# EAGLE design tc4_shieldproto (EAGLE 5.10)
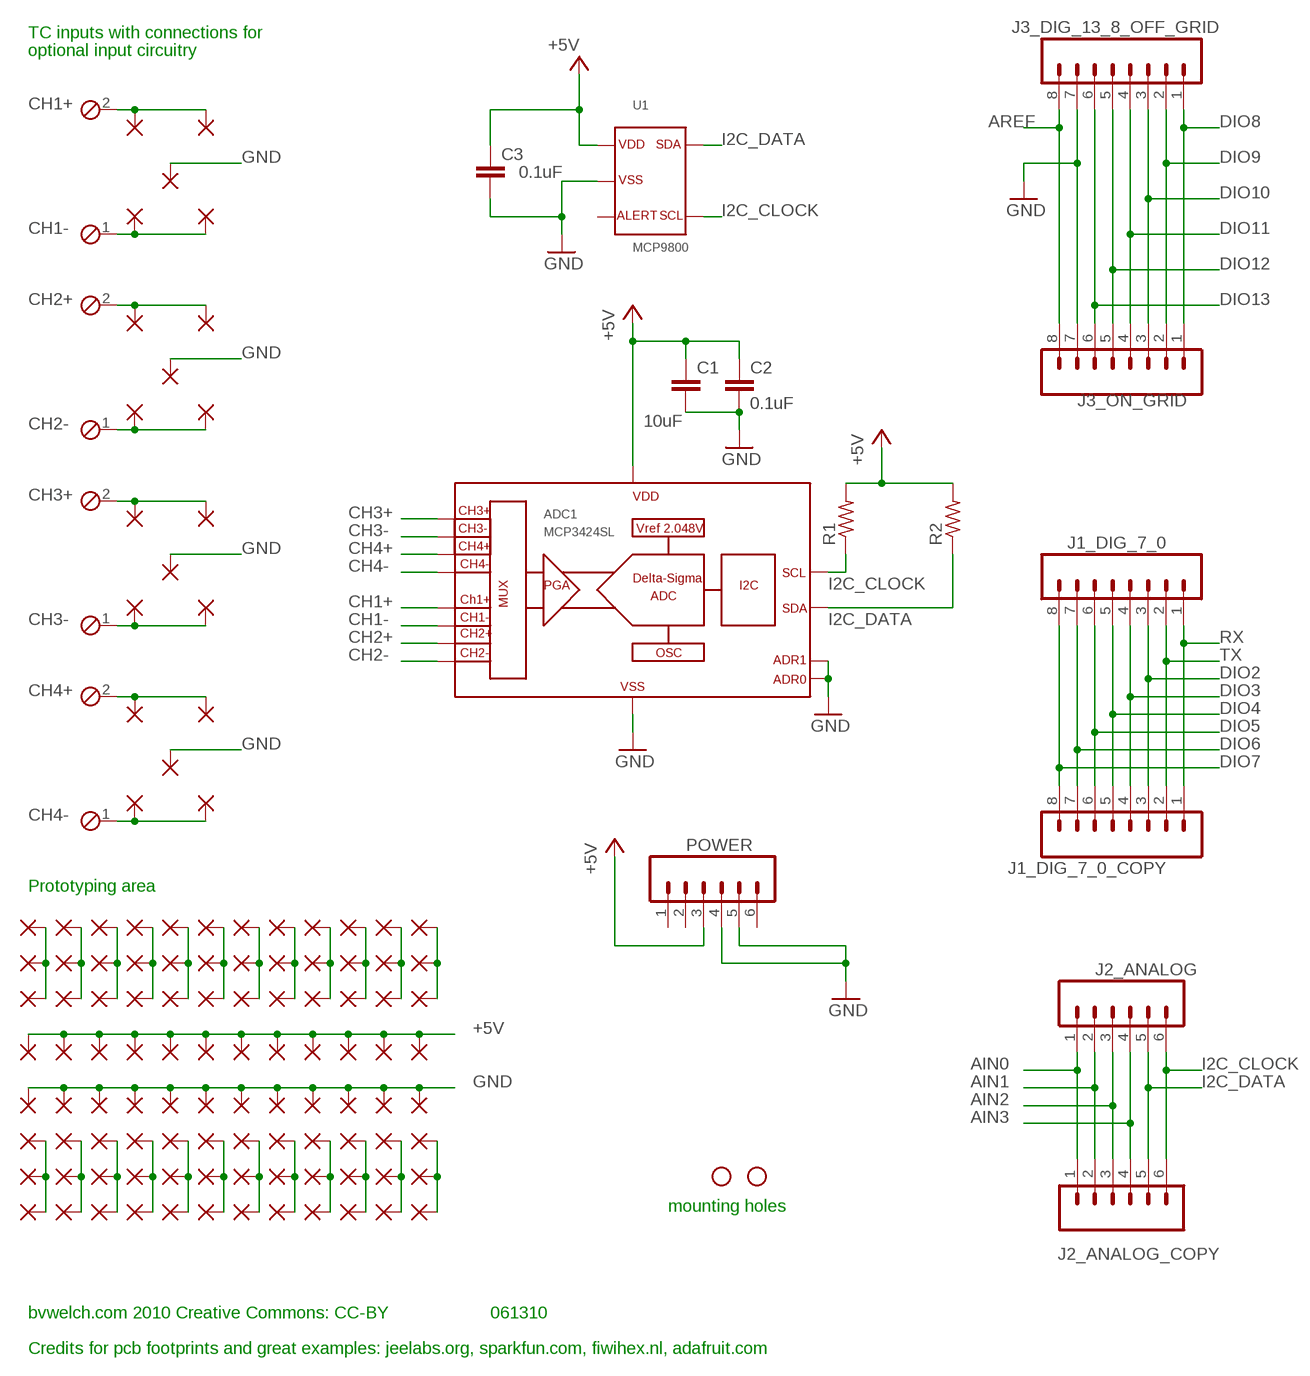
[diagram p0: schematic, sheet 1]

## Parts
ADC1  MCP3424SL  [SO14]
C1  10uF  C-EUC1206  [C1206]
C2  0.1uF  C-EUC1206  [C1206]
C3  0.1uF  C-EUC1206  [C1206]
J1_DIG_7_0  M08  [1X08]
J1_DIG_7_0_COPY  M08  [1X08]
J2_ANALOG  M06SIP  [1X06]
J2_ANALOG_COPY  M06SIP  [1X06]
J3_DIG_13_8_OFF_GRID  M08  [1X08]
J3_ON_GRID  M08  [1X08]
JP1  STAND-OFF  [STAND-OFF]
JP2  STAND-OFF  [STAND-OFF]
PAD1  1,6/0,8  [1,6/0,8]
PAD2  WIREPAD1,6/0,8  [1,6/0,8]
PAD3  1,6/0,8  [1,6/0,8]
PAD4  WIREPAD1,6/0,8  [1,6/0,8]
PAD5  WIREPAD1,6/0,8  [1,6/0,8]
PAD6  1,6/0,8  [1,6/0,8]
PAD7  1,6/0,8  [1,6/0,8]
PAD8  WIREPAD1,6/0,8  [1,6/0,8]
PAD9  1,6/0,8  [1,6/0,8]
PAD10  1,6/0,8  [1,6/0,8]
PAD11  WIREPAD1,6/0,8  [1,6/0,8]
PAD12  1,6/0,8  [1,6/0,8]
PAD13  WIREPAD1,6/0,8  [1,6/0,8]
PAD14  WIREPAD1,6/0,8  [1,6/0,8]
PAD15  1,6/0,8  [1,6/0,8]
PAD16  1,6/0,8  [1,6/0,8]
PAD17  WIREPAD1,6/0,8  [1,6/0,8]
PAD18  1,6/0,8  [1,6/0,8]
PAD19  1,6/0,8  [1,6/0,8]
PAD20  WIREPAD1,6/0,8  [1,6/0,8]
PAD21  1,6/0,8  [1,6/0,8]
PAD22  WIREPAD1,6/0,8  [1,6/0,8]
PAD23  WIREPAD1,6/0,8  [1,6/0,8]
PAD24  1,6/0,8  [1,6/0,8]
PAD25  1,6/0,8  [1,6/0,8]
PAD26  WIREPAD1,6/0,8  [1,6/0,8]
PAD27  1,6/0,8  [1,6/0,8]
PAD28  1,6/0,8  [1,6/0,8]
PAD29  WIREPAD1,6/0,8  [1,6/0,8]
PAD30  1,6/0,8  [1,6/0,8]
PAD31  WIREPAD1,6/0,8  [1,6/0,8]
PAD32  WIREPAD1,6/0,8  [1,6/0,8]
PAD33  1,6/0,8  [1,6/0,8]
PAD34  1,6/0,8  [1,6/0,8]
PAD35  WIREPAD1,6/0,8  [1,6/0,8]
PAD36  1,6/0,8  [1,6/0,8]
PAD37  WIREPAD1,6/0,8  [1,6/0,8]
PAD38  WIREPAD1,6/0,8  [1,6/0,8]
PAD39  WIREPAD1,6/0,8  [1,6/0,8]
PAD40  WIREPAD1,6/0,8  [1,6/0,8]
PAD41  WIREPAD1,6/0,8  [1,6/0,8]
PAD42  WIREPAD1,6/0,8  [1,6/0,8]
PAD43  WIREPAD1,6/0,8  [1,6/0,8]
PAD44  WIREPAD1,6/0,8  [1,6/0,8]
PAD45  WIREPAD1,6/0,8  [1,6/0,8]
PAD46  WIREPAD1,6/0,8  [1,6/0,8]
PAD47  WIREPAD1,6/0,8  [1,6/0,8]
PAD48  WIREPAD1,6/0,8  [1,6/0,8]
PAD49  WIREPAD1,6/0,8  [1,6/0,8]
PAD50  WIREPAD1,6/0,8  [1,6/0,8]
PAD51  WIREPAD1,6/0,8  [1,6/0,8]
PAD52  WIREPAD1,6/0,8  [1,6/0,8]
PAD53  WIREPAD1,6/0,8  [1,6/0,8]
PAD54  WIREPAD1,6/0,8  [1,6/0,8]
PAD55  WIREPAD1,6/0,8  [1,6/0,8]
PAD56  WIREPAD1,6/0,8  [1,6/0,8]
PAD57  WIREPAD1,6/0,8  [1,6/0,8]
PAD58  WIREPAD1,6/0,8  [1,6/0,8]
PAD59  WIREPAD1,6/0,8  [1,6/0,8]
PAD60  WIREPAD1,6/0,8  [1,6/0,8]
PAD61  WIREPAD1,6/0,8  [1,6/0,8]
PAD62  WIREPAD1,6/0,8  [1,6/0,8]
PAD63  WIREPAD1,6/0,8  [1,6/0,8]
PAD64  WIREPAD1,6/0,8  [1,6/0,8]
PAD65  WIREPAD1,6/0,8  [1,6/0,8]
PAD66  WIREPAD1,6/0,8  [1,6/0,8]
PAD67  WIREPAD1,6/0,8  [1,6/0,8]
PAD68  WIREPAD1,6/0,8  [1,6/0,8]
PAD69  WIREPAD1,6/0,8  [1,6/0,8]
PAD70  WIREPAD1,6/0,8  [1,6/0,8]
PAD71  WIREPAD1,6/0,8  [1,6/0,8]
PAD72  WIREPAD1,6/0,8  [1,6/0,8]
PAD73  WIREPAD1,6/0,8  [1,6/0,8]
PAD74  WIREPAD1,6/0,8  [1,6/0,8]
PAD75  WIREPAD1,6/0,8  [1,6/0,8]
PAD76  WIREPAD1,6/0,8  [1,6/0,8]
PAD77  WIREPAD1,6/0,8  [1,6/0,8]
PAD78  WIREPAD1,6/0,8  [1,6/0,8]
PAD79  WIREPAD1,6/0,8  [1,6/0,8]
PAD80  WIREPAD1,6/0,8  [1,6/0,8]
PAD81  WIREPAD1,6/0,8  [1,6/0,8]
PAD82  WIREPAD1,6/0,8  [1,6/0,8]
PAD83  WIREPAD1,6/0,8  [1,6/0,8]
PAD84  WIREPAD1,6/0,8  [1,6/0,8]
PAD85  WIREPAD1,6/0,8  [1,6/0,8]
PAD86  WIREPAD1,6/0,8  [1,6/0,8]
PAD87  WIREPAD1,6/0,8  [1,6/0,8]
PAD88  WIREPAD1,6/0,8  [1,6/0,8]
PAD89  WIREPAD1,6/0,8  [1,6/0,8]
PAD90  WIREPAD1,6/0,8  [1,6/0,8]
PAD91  WIREPAD1,6/0,8  [1,6/0,8]
PAD92  WIREPAD1,6/0,8  [1,6/0,8]
PAD93  WIREPAD1,6/0,8  [1,6/0,8]
PAD94  WIREPAD1,6/0,8  [1,6/0,8]
PAD95  WIREPAD1,6/0,8  [1,6/0,8]
PAD96  WIREPAD1,6/0,8  [1,6/0,8]
PAD97  WIREPAD1,6/0,8  [1,6/0,8]
PAD98  WIREPAD1,6/0,8  [1,6/0,8]
PAD99  WIREPAD1,6/0,8  [1,6/0,8]
PAD100  WIREPAD1,6/0,8  [1,6/0,8]
PAD101  WIREPAD1,6/0,8  [1,6/0,8]
PAD102  WIREPAD1,6/0,8  [1,6/0,8]
PAD103  WIREPAD1,6/0,8  [1,6/0,8]
PAD104  WIREPAD1,6/0,8  [1,6/0,8]
PAD105  WIREPAD1,6/0,8  [1,6/0,8]
PAD106  WIREPAD1,6/0,8  [1,6/0,8]
PAD107  WIREPAD1,6/0,8  [1,6/0,8]
PAD108  WIREPAD1,6/0,8  [1,6/0,8]
PAD109  WIREPAD1,6/0,8  [1,6/0,8]
PAD110  WIREPAD1,6/0,8  [1,6/0,8]
PAD111  WIREPAD1,6/0,8  [1,6/0,8]
PAD112  WIREPAD1,6/0,8  [1,6/0,8]
PAD113  WIREPAD1,6/0,8  [1,6/0,8]
PAD114  WIREPAD1,6/0,8  [1,6/0,8]
PAD115  WIREPAD1,6/0,8  [1,6/0,8]
PAD116  WIREPAD1,6/0,8  [1,6/0,8]
POWER  M06SIP  [1X06]
R1  R-US_R1206  [R1206]
R2  R-US_R1206  [R1206]
TC1  MPT2  [2POL254]
TC2  MPT2  [2POL254]
TC3  MPT2  [2POL254]
TC4  MPT2  [2POL254]
U1  MCP9800  [SOT23-5L]

## Nets
+5V: ADC1.6 C1.1 C2.1 C3.1 PAD2.1(P) PAD4.1(P) PAD5.1(P) PAD8.1(P) PAD13.1(P) PAD17.1(P) PAD20.1(P) PAD23.1(P) PAD26.1(P) PAD29.1(P) PAD32.1(P) PAD35.1(P) POWER.3 R1.2 R2.2 U1.1
AIN0: J2_ANALOG.1 J2_ANALOG_COPY.1
AIN1: J2_ANALOG.2 J2_ANALOG_COPY.2
AIN2: J2_ANALOG.3 J2_ANALOG_COPY.3
AIN3: J2_ANALOG.4 J2_ANALOG_COPY.4
AREF: J3_DIG_13_8_OFF_GRID.8 J3_ON_GRID.8
CH1+: ADC1.1 PAD19.1(P) PAD21.1(P) TC1.2
CH1-: ADC1.2 PAD25.1(P) PAD27.1(P) TC1.1
CH2+: ADC1.3 PAD28.1(P) PAD30.1(P) TC2.2
CH2-: ADC1.4 PAD34.1(P) PAD36.1(P) TC2.1
CH3+: ADC1.11 PAD1.1(P) PAD3.1(P) TC3.2
CH3-: ADC1.12 PAD7.1(P) PAD9.1(P) TC3.1
CH4+: ADC1.13 PAD10.1(P) PAD12.1(P) TC4.2
CH4-: ADC1.14 PAD16.1(P) PAD18.1(P) TC4.1
DIO2: J1_DIG_7_0.3 J1_DIG_7_0_COPY.3
DIO3: J1_DIG_7_0.4 J1_DIG_7_0_COPY.4
DIO4: J1_DIG_7_0.5 J1_DIG_7_0_COPY.5
DIO5: J1_DIG_7_0.6 J1_DIG_7_0_COPY.6
DIO6: J1_DIG_7_0.7 J1_DIG_7_0_COPY.7
DIO7: J1_DIG_7_0.8 J1_DIG_7_0_COPY.8
DIO8: J3_DIG_13_8_OFF_GRID.1 J3_ON_GRID.1
DIO9: J3_DIG_13_8_OFF_GRID.2 J3_ON_GRID.2
DIO10: J3_DIG_13_8_OFF_GRID.3 J3_ON_GRID.3
DIO11: J3_DIG_13_8_OFF_GRID.4 J3_ON_GRID.4
DIO12: J3_DIG_13_8_OFF_GRID.5 J3_ON_GRID.5
DIO13: J3_DIG_13_8_OFF_GRID.6 J3_ON_GRID.6
GND: ADC1.5 ADC1.9 ADC1.10 C1.2 C2.2 C3.2 J3_DIG_13_8_OFF_GRID.7 J3_ON_GRID.7 PAD6.1(P) PAD11.1(P) PAD14.1(P) PAD15.1(P) PAD22.1(P) PAD24.1(P) PAD31.1(P) PAD33.1(P) PAD37.1(P) PAD42.1(P) PAD43.1(P) PAD44.1(P) PAD45.1(P) PAD46.1(P) PAD47.1(P) PAD48.1(P) POWER.4 POWER.5 U1.2
I2C_CLOCK: ADC1.8 J2_ANALOG.6 J2_ANALOG_COPY.6 R1.1 U1.4
I2C_DATA: ADC1.7 J2_ANALOG.5 J2_ANALOG_COPY.5 R2.1 U1.5
N$1: PAD49.1(P) PAD61.1(P) PAD73.1(P)
N$2: PAD50.1(P) PAD62.1(P) PAD74.1(P)
N$3: PAD51.1(P) PAD63.1(P) PAD75.1(P)
N$4: PAD52.1(P) PAD64.1(P) PAD76.1(P)
N$5: PAD53.1(P) PAD65.1(P) PAD77.1(P)
N$6: PAD54.1(P) PAD66.1(P) PAD78.1(P)
N$7: PAD55.1(P) PAD67.1(P) PAD79.1(P)
N$10: PAD38.1(P) PAD57.1(P) PAD69.1(P)
N$11: PAD39.1(P) PAD58.1(P) PAD70.1(P)
N$12: PAD40.1(P) PAD59.1(P) PAD71.1(P)
N$13: PAD85.1(P) PAD97.1(P) PAD109.1(P)
N$14: PAD86.1(P) PAD98.1(P) PAD110.1(P)
N$15: PAD87.1(P) PAD99.1(P) PAD111.1(P)
N$16: PAD88.1(P) PAD100.1(P) PAD112.1(P)
N$17: PAD89.1(P) PAD101.1(P) PAD113.1(P)
N$18: PAD90.1(P) PAD102.1(P) PAD114.1(P)
N$19: PAD91.1(P) PAD103.1(P) PAD115.1(P)
N$20: PAD41.1(P) PAD60.1(P) PAD72.1(P)
N$21: PAD56.1(P) PAD68.1(P) PAD80.1(P)
N$22: PAD81.1(P) PAD93.1(P) PAD105.1(P)
N$23: PAD82.1(P) PAD94.1(P) PAD106.1(P)
N$24: PAD83.1(P) PAD95.1(P) PAD107.1(P)
N$25: PAD84.1(P) PAD96.1(P) PAD108.1(P)
N$26: PAD92.1(P) PAD104.1(P) PAD116.1(P)
RX: J1_DIG_7_0.1 J1_DIG_7_0_COPY.1
TX: J1_DIG_7_0.2 J1_DIG_7_0_COPY.2
Unconnected: POWER.1 POWER.2 POWER.6 U1.3

## Notes on the sheet
- TC inputs with connections for
- optional input circuitry
- Prototyping area
- mounting holes
- bvwelch.com 2010 Creative Commons: CC-BY | 061310
- Credits for pcb footprints and great examples: jeelabs.org, sparkfun.com, fiwihex.nl, adafruit.com

## Library data of the parts
ADC1 = newparts_2010:MCP3424: 18-bit multi-channel delta-sigma AD converter with I2C interface. Microchip. Farnell 1630424
C1-C3 = rcl:C-EU: CAPACITOR, European symbol
J1_DIG_7_0 J1_DIG_7_0_COPY J3_DIG_13_8_OFF_GRID J3_ON_GRID = SparkFun:M08: Header 8 Standard 8-pin 0.1" header. Use with straight break away headers (SKU : PRT-00116), right angle break away headers (PRT-00553), swiss pins (PRT-00743), machine pins (PRT-00117), and female headers (PRT-00115).
J2_ANALOG J2_ANALOG_COPY POWER = SparkFun:M06: Header 6 Standard 6-pin 0.1" header. Use with straight break away headers (SKU : PRT-00116), right angle break away headers (PRT-00553), swiss pins (PRT-00743), machine pins (PRT-00117), and female headers (PRT-00115). Molex polarized connector foot print use with SKU : PRT-08094 with associated crimp pins and housings. NOTES ON THE VARIANTS LOCK and LOCK_LONGPADS... This footprint was designed to help hold the alignment of a through-hole component (i.e. 6-pin header) while soldering it into place. You may notice that each hole has been shifted either up or down by 0.005 of an inch from it's more standard position (which is a perfectly straight line). This slight alteration caused the pins (the squares in the middle) to touch the edges of the holes. Because they are alternating, it causes a "brace" to hold the component in place. 0.005 has proven to be the perfect amount of "off-center" position when using our standard breakaway headers. Although looks a little odd when you look at the bare footprint, once you have a header in there, the alteration is very hard to notice. Also, if you push a header all the way into place, it is covered up entirely on the bottom side. This idea of altering the position of holes to aid alignment will be further integrated into the Sparkfun Library for other footprints. It can help hold any component with 3 or more connection pins.
JP1 JP2 = SparkFun:STAND-OFF: Stand Off This is the mechanical footprint for a #4 phillips button head screw. Use the keepout ring to avoid running the screw head into surrounding components. SKU : PRT-00447
PAD1 PAD3 PAD6 PAD7 PAD9 PAD10 PAD12 PAD15 PAD16 PAD18 PAD19 PAD21 PAD24 PAD25 PAD27 PAD28 PAD30 PAD33 PAD34 PAD36 = wirepad:1,6/0,8: THROUGH-HOLE PAD
PAD2 PAD4 PAD5 PAD8 PAD11 PAD13 PAD14 PAD17 PAD20 PAD22 PAD23 PAD26 PAD29 PAD31 PAD32 PAD35 PAD37-PAD116 = wirepad:WIREPAD: Wire PAD connect wire on PCB
R1 R2 = rcl:R-US_: RESISTOR, American symbol
TC1-TC4 = newparts_2006:MPT2: PHOENIX CONNECTOR
U1 = newparts_2010:MCP9800: Temperature sensor I2C output, Microchip. Farnell 1439485

## Board
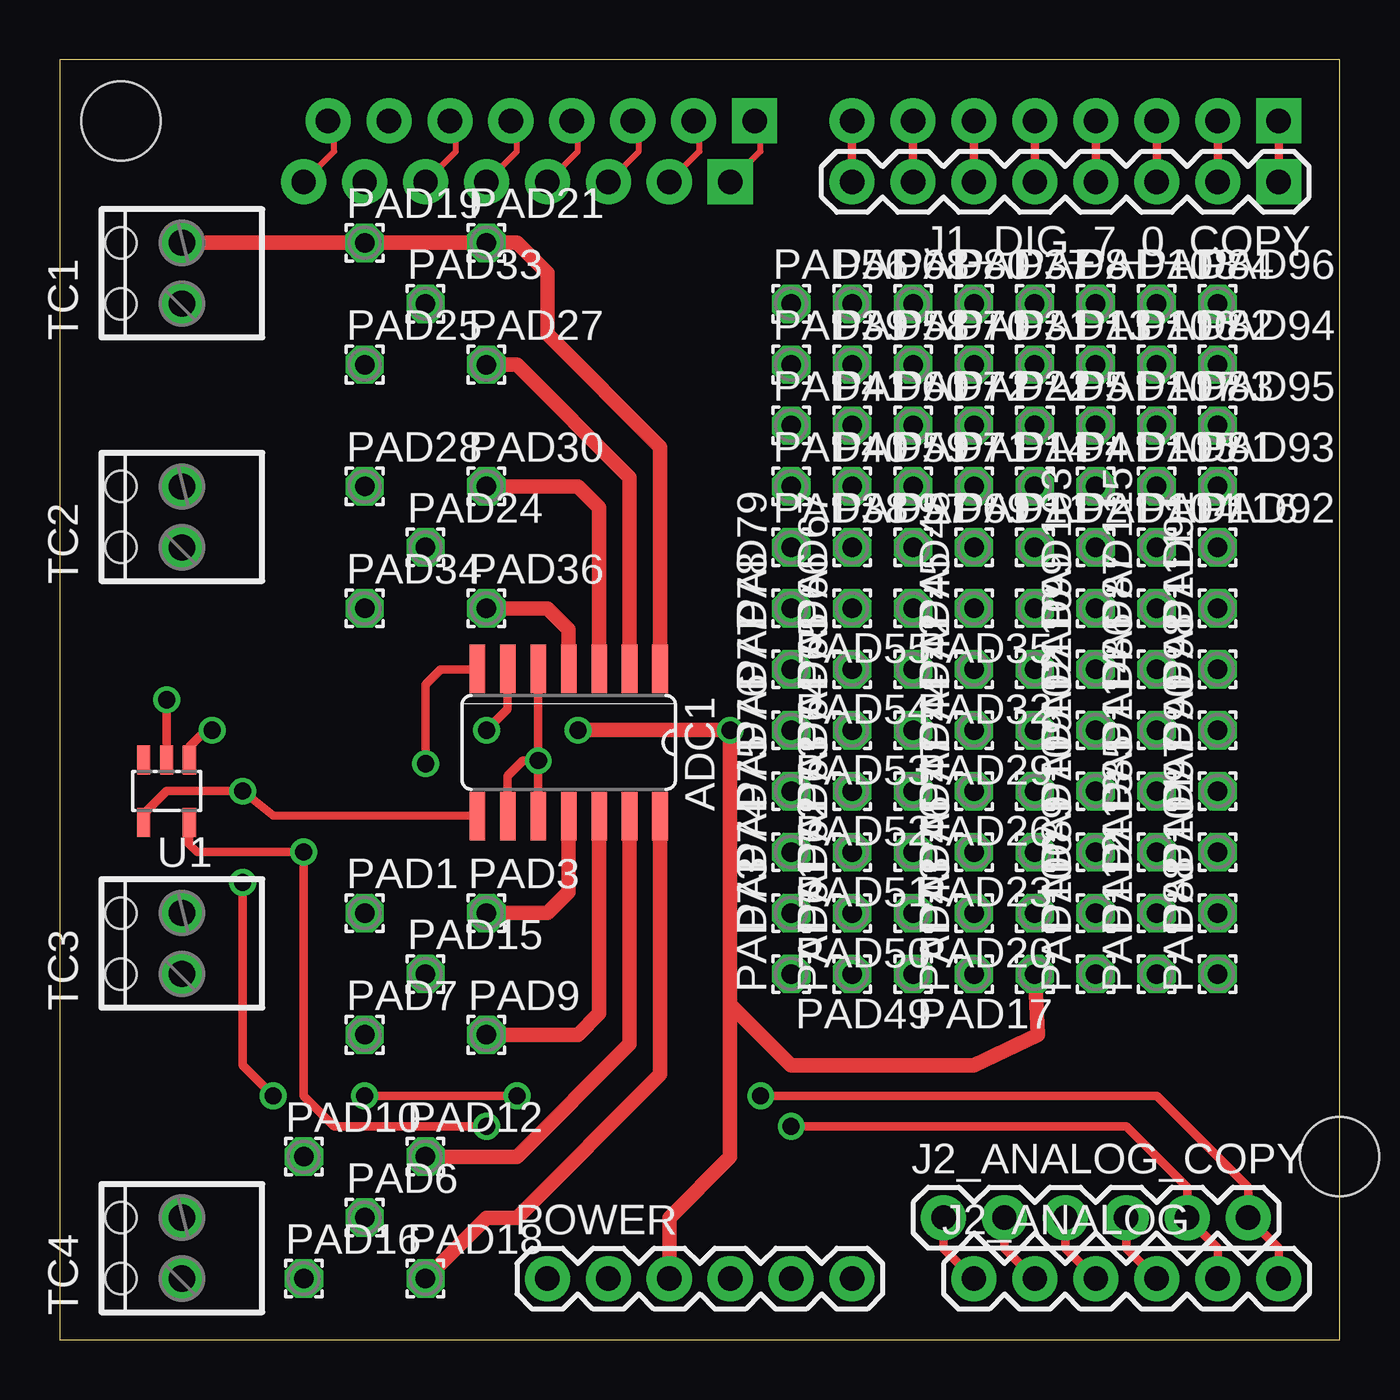
[diagram p1: board, top side]
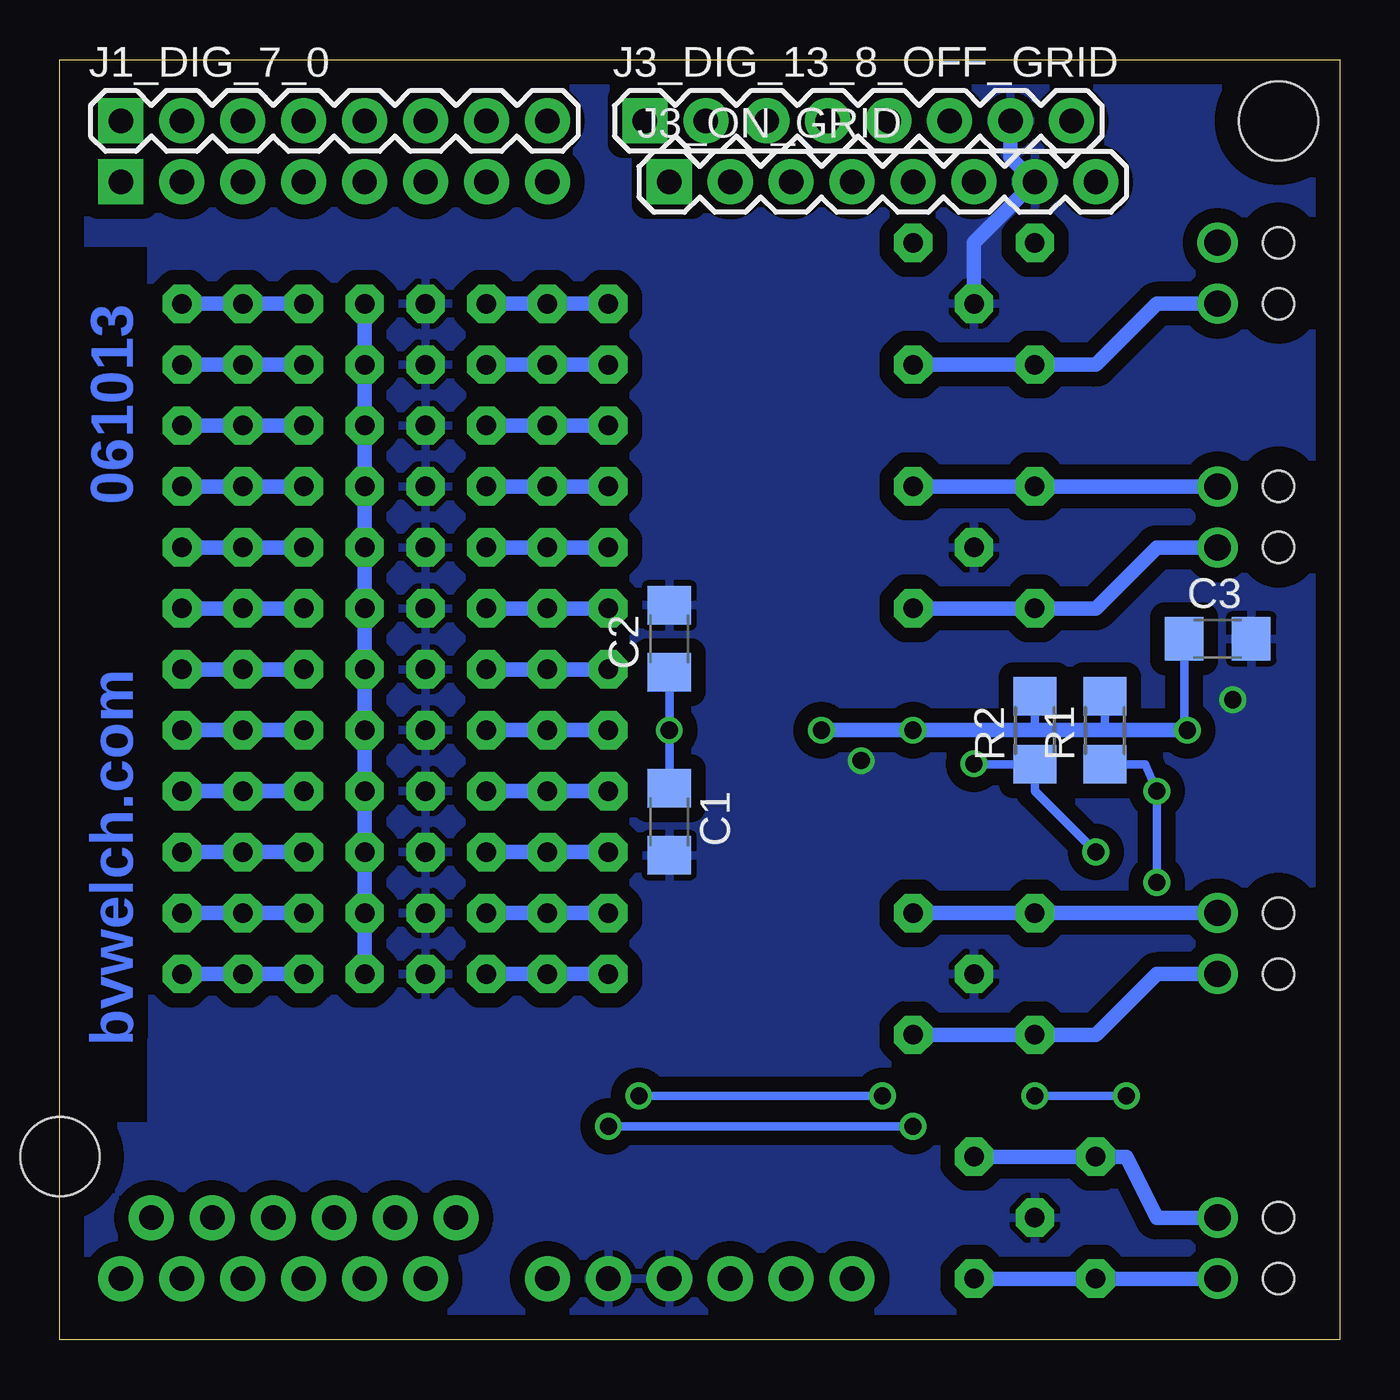
[diagram p2: board, bottom side, seen from below]

Size 53.34 x 53.34 mm. Coordinates in mm from the lower left corner, seen from the top.
Outline: 0,0 53.34,0 53.34,53.34 0,53.34 0,0
Copper layers (1*16): Top 0.035mm / dielectric 1.5mm / Bottom 0.035mm
Design rules "Olimex10mils": minimum track width 10mil, minimum drill 24mil, track to track 10mil, track to pad 10mil, pad to pad 10mil, via to via 10mil, smd to smd 10mil, copper to edge 40mil, drill to drill 10mil, minimum pad ring 10mil, minimum via ring 8mil, stop-mask expansion 0mil, vias tented up to drill 0mil, thermal gap 10mil

### Footprints (pad centres in the part's own frame; a part is rotated, then mirrored left to right if it is on the bottom)
SO14 = smd 0.66 x 2.032: 1 -3.81,-3.073; 2 -2.54,-3.073; 3 -1.27,-3.073; 4 0,-3.073; 5 1.27,-3.073; 6 2.54,-3.073; 7 3.81,-3.073; 8 3.81,3.073; 9 2.54,3.073; 10 1.27,3.073; 11 0,3.073; 12 -1.27,3.073; 13 -2.54,3.073; 14 -3.81,3.073
C1206 = smd 1.6 x 1.8: 1 -1.4,0; 2 1.4,0
1X08 = drill 1.016 pad 1.88 square: 1 0,0 | drill 1.016 pad 1.88 round: 2 2.54,0; 3 5.08,0; 4 7.62,0; 5 10.16,0; 6 12.7,0; 7 15.24,0; 8 17.78,0
1X06 = drill 1.016 pad 1.88 round: 1 0,0; 2 2.54,0; 3 5.08,0; 4 7.62,0; 5 10.16,0; 6 12.7,0
STAND-OFF = hole 3.302: 0,0
1,6/0,8 = drill 0.813 pad 1.6 octagon: 1 0,0
R1206 = smd 1.6 x 1.803: 1 -1.422,0; 2 1.422,0
2POL254 = drill 1.092 pad 1.676 round: 1 -1.27,0; 2 1.27,0 | hole 1.295: -1.27,2.54; 1.27,2.54
SOT23-5L = smd 0.55 x 1.2: 1 -0.95,-1.3; 2 0,-1.3; 3 0.95,-1.3; 4 0.95,1.3; 5 -0.95,1.3

### Placement (x,y rotation side)
ADC1  21.21,24.89 180 top
C1  27.94,21.59 270 bottom
C2  27.94,29.21 90 bottom
C3  5.08,29.21 0 bottom
J1_DIG_7_0  50.8,50.8 0 bottom
J1_DIG_7_0_COPY  50.8,48.26 180 top
J2_ANALOG  38.1,2.54 0 top
J2_ANALOG_COPY  36.83,5.08 0 top
J3_DIG_13_8_OFF_GRID  28.96,50.8 0 bottom
J3_ON_GRID  27.94,48.26 0 bottom
JP1  53.34,7.62 180 top
JP2  2.54,50.8 180 top
PAD1  12.7,17.78 0 top
PAD2  40.64,33.02 0 top
PAD3  17.78,17.78 0 top
PAD4  40.64,35.56 0 top
PAD5  40.64,38.1 0 top
PAD6  12.7,5.08 0 top
PAD7  12.7,12.7 0 top
PAD8  40.64,43.18 0 top
PAD9  17.78,12.7 0 top
PAD10  10.16,7.62 0 top
PAD11  38.1,33.02 0 top
PAD12  15.24,7.62 0 top
PAD13  40.64,40.64 0 top
PAD14  38.1,35.56 0 top
PAD15  15.24,15.24 0 top
PAD16  10.16,2.54 0 top
PAD17  40.64,15.24 180 top
PAD18  15.24,2.54 0 top
PAD19  12.7,45.72 0 top
PAD20  40.64,17.78 180 top
PAD21  17.78,45.72 0 top
PAD22  38.1,38.1 0 top
PAD23  40.64,20.32 180 top
PAD24  15.24,33.02 0 top
PAD25  12.7,40.64 0 top
PAD26  40.64,22.86 180 top
PAD27  17.78,40.64 0 top
PAD28  12.7,35.56 0 top
PAD29  40.64,25.4 180 top
PAD30  17.78,35.56 0 top
PAD31  38.1,40.64 0 top
PAD32  40.64,27.94 180 top
PAD33  15.24,43.18 0 top
PAD34  12.7,30.48 0 top
PAD35  40.64,30.48 180 top
PAD36  17.78,30.48 0 top
PAD37  38.1,43.18 0 top
PAD38  30.48,33.02 0 top
PAD39  30.48,40.64 0 top
PAD40  30.48,35.56 0 top
PAD41  30.48,38.1 0 top
PAD42  38.1,25.4 90 top
PAD43  38.1,15.24 90 top
PAD44  38.1,22.86 90 top
PAD45  38.1,27.94 90 top
PAD46  38.1,17.78 90 top
PAD47  38.1,20.32 90 top
PAD48  38.1,30.48 90 top
PAD49  35.56,15.24 180 top
PAD50  35.56,17.78 180 top
PAD51  35.56,20.32 180 top
PAD52  35.56,22.86 180 top
PAD53  35.56,25.4 180 top
PAD54  35.56,27.94 180 top
PAD55  35.56,30.48 180 top
PAD56  30.48,43.18 0 top
PAD57  33.02,33.02 0 top
PAD58  33.02,40.64 0 top
PAD59  33.02,35.56 0 top
PAD60  33.02,38.1 0 top
PAD61  33.02,15.24 90 top
PAD62  33.02,17.78 90 top
PAD63  33.02,20.32 90 top
PAD64  33.02,22.86 90 top
PAD65  33.02,25.4 90 top
PAD66  33.02,27.94 90 top
PAD67  33.02,30.48 90 top
PAD68  33.02,43.18 0 top
PAD69  35.56,33.02 0 top
PAD70  35.56,40.64 0 top
PAD71  35.56,35.56 0 top
PAD72  35.56,38.1 0 top
PAD73  30.48,15.24 90 top
PAD74  30.48,17.78 90 top
PAD75  30.48,20.32 90 top
PAD76  30.48,22.86 90 top
PAD77  30.48,25.4 90 top
PAD78  30.48,27.94 90 top
PAD79  30.48,30.48 90 top
PAD80  35.56,43.18 0 top
PAD81  45.72,35.56 0 top
PAD82  45.72,40.64 0 top
PAD83  45.72,38.1 0 top
PAD84  45.72,43.18 0 top
PAD85  45.72,20.32 90 top
PAD86  45.72,25.4 90 top
PAD87  45.72,27.94 90 top
PAD88  48.26,15.24 90 top
PAD89  43.18,17.78 90 top
PAD90  48.26,22.86 90 top
PAD91  48.26,30.48 90 top
PAD92  48.26,33.02 0 top
PAD93  48.26,35.56 0 top
PAD94  48.26,40.64 0 top
PAD95  48.26,38.1 0 top
PAD96  48.26,43.18 0 top
PAD97  48.26,20.32 90 top
PAD98  48.26,25.4 90 top
PAD99  43.18,27.94 90 top
PAD100  43.18,15.24 90 top
PAD101  48.26,17.78 90 top
PAD102  43.18,22.86 90 top
PAD103  43.18,30.48 90 top
PAD104  43.18,33.02 0 top
PAD105  43.18,35.56 0 top
PAD106  43.18,40.64 0 top
PAD107  43.18,38.1 0 top
PAD108  43.18,43.18 0 top
PAD109  43.18,20.32 90 top
PAD110  43.18,25.4 90 top
PAD111  48.26,27.94 90 top
PAD112  45.72,15.24 90 top
PAD113  45.72,17.78 90 top
PAD114  45.72,22.86 90 top
PAD115  45.72,30.48 90 top
PAD116  45.72,33.02 0 top
POWER  20.32,2.54 0 top
R1  9.78,25.4 90 bottom
R2  12.7,25.4 90 bottom
TC1  5.08,44.45 90 top
TC2  5.08,34.29 90 top
TC3  5.08,16.51 90 top
TC4  5.08,3.81 90 top
U1  4.45,22.86 180 top

### Tracks (layer width: path | path; a pad name or v marks a point on that pad's centre or on a via)
+5V  (via drill 0.71)
  Top 0.356: ADC1.6 18.67,26.29 v17.78,25.4 | U1.1 5.39,24.7 6.1,25.4 v6.35,25.4
  Top 0.61: v21.59,25.4 v27.94,25.4 27.94,13.97 | POWER.3 25.4,5.08 27.94,7.62 27.94,13.97 | PAD17.1 40.77,12.7 38.1,11.43 30.48,11.43 27.94,13.97
  Bottom 0.356: C3.1 6.48,25.53 v6.35,25.4 | R1.2 9.78,25.53 9.65,25.4 | 12.7,25.4 R2.2 | C2.1 v27.94,25.4 C1.1
  Bottom 0.61: v6.35,25.4 9.65,25.4 12.7,25.4 v17.78,25.4 v21.59,25.4 | PAD17.1 PAD20.1 PAD23.1 PAD26.1 PAD29.1 PAD32.1 PAD35.1 PAD2.1 PAD4.1 PAD5.1 PAD13.1 PAD8.1
AIN0
  Top 0.356: J2_ANALOG.1 36.83,3.81 J2_ANALOG_COPY.1
AIN1
  Top 0.356: J2_ANALOG.2 39.37,3.81 J2_ANALOG_COPY.2
AIN2
  Top 0.356: J2_ANALOG.3 41.91,3.81 J2_ANALOG_COPY.3
AIN3
  Top 0.356: J2_ANALOG.4 44.45,3.81 J2_ANALOG_COPY.4
AREF
  Top 0.254: J3_ON_GRID.8 11.43,49.53 11.43,50.8 J3_DIG_13_8_OFF_GRID.8
CH1+
  Top 0.61: TC1.2 PAD19.1 PAD21.1 19.05,45.72 20.32,44.45 20.32,41.91 25.02,37.21 ADC1.1
CH1-
  Top 0.61: ADC1.2 23.75,35.94 19.05,40.64 PAD27.1
  Bottom 0.61: TC1.1 7.62,43.18 10.16,40.64 PAD25.1 PAD27.1
CH2+
  Top 0.61: ADC1.3 22.48,34.67 21.59,35.56 PAD30.1
  Bottom 0.61: TC2.2 PAD28.1 PAD30.1
CH2-
  Top 0.61: ADC1.4 21.21,29.59 20.32,30.48 PAD36.1
  Bottom 0.61: TC2.1 7.62,33.02 10.16,30.48 PAD34.1 PAD36.1
CH3+
  Top 0.61: ADC1.11 21.21,18.67 20.32,17.78 PAD3.1
  Bottom 0.61: TC3.2 PAD1.1 PAD3.1
CH3-
  Top 0.61: ADC1.12 22.48,13.59 21.59,12.7 PAD9.1
  Bottom 0.61: TC3.1 7.62,15.24 10.16,12.7 PAD7.1 PAD9.1
CH4+
  Top 0.61: ADC1.13 23.75,12.32 19.05,7.62 PAD12.1
  Bottom 0.61: TC4.2 7.62,5.08 8.89,7.62 PAD10.1 PAD12.1
CH4-
  Top 0.61: ADC1.14 25.02,11.05 19.05,5.08 17.78,5.08 PAD18.1
  Bottom 0.61: TC4.1 PAD16.1 PAD18.1
DIO2
  Top 0.356: J1_DIG_7_0_COPY.3 J1_DIG_7_0.3
DIO3
  Top 0.356: J1_DIG_7_0_COPY.4 J1_DIG_7_0.4
DIO4
  Top 0.356: J1_DIG_7_0_COPY.5 J1_DIG_7_0.5
DIO5
  Top 0.356: J1_DIG_7_0_COPY.6 J1_DIG_7_0.6
DIO6
  Top 0.356: J1_DIG_7_0_COPY.7 J1_DIG_7_0.7
DIO7
  Top 0.356: J1_DIG_7_0_COPY.8 J1_DIG_7_0.8
DIO8
  Top 0.254: J3_ON_GRID.1 29.21,49.53 29.21,50.8 J3_DIG_13_8_OFF_GRID.1
DIO9
  Top 0.254: J3_ON_GRID.2 26.67,49.53 26.67,50.8 J3_DIG_13_8_OFF_GRID.2
DIO10
  Top 0.254: J3_ON_GRID.3 24.13,49.53 24.13,50.8 J3_DIG_13_8_OFF_GRID.3
DIO11
  Top 0.254: J3_ON_GRID.4 21.59,49.53 21.59,50.8 J3_DIG_13_8_OFF_GRID.4
DIO12
  Top 0.254: J3_ON_GRID.5 19.05,49.53 19.05,50.8 J3_DIG_13_8_OFF_GRID.5
DIO13
  Top 0.254: J3_ON_GRID.6 16.51,49.53 16.51,50.8 J3_DIG_13_8_OFF_GRID.6
GND  (via drill 0.71)
  Top 0.254: U1.2 4.45,24.13
  Top 0.356: U1.2 v4.45,26.67 | v19.94,24.13 ADC1.5 | ADC1.10 v19.94,24.13 | ADC1.9 18.67,23.5 19.3,24.13 v19.94,24.13
  Bottom 0.61: J3_DIG_13_8_OFF_GRID.7 13.72,49.28 J3_ON_GRID.7 15.24,45.72 PAD33.1
  pour Bottom (isolate 0.61): 0,53.34 53.34,53.34 53.34,45.72 49.53,45.72 49.53,8.89 53.34,8.89 53.34,0 0,0
I2C_CLOCK  (via drill 0.71)
  Top 0.356: U1.4 3.5,21.91 4.45,22.86 v7.62,22.86 8.89,21.84 ADC1.8 | v7.62,19.05 7.62,11.43 v8.89,10.16 | v29.21,10.16 45.72,10.16 49.53,6.35 J2_ANALOG_COPY.6 50.8,3.81 J2_ANALOG.6 | v12.7,10.16 v19.05,10.16
  Bottom 0.356: R1.1 8.1,23.98 v7.62,22.86 v7.62,19.05 | v8.89,10.16 v12.7,10.16 | v19.05,10.16 v29.21,10.16
I2C_DATA  (via drill 0.71)
  Top 0.356: U1.5 5.39,20.64 5.71,20.32 v10.16,20.32 10.16,10.16 11.43,8.89 v17.78,8.89 | v15.24,24 15.24,27.3 15.88,27.94 17.37,27.94 ADC1.7 | v30.48,8.89 44.45,8.89 46.99,6.35 J2_ANALOG_COPY.5 48.26,3.81 J2_ANALOG.5
  Bottom 0.356: v10.16,20.32 12.7,22.86 R2.1 15.21,23.98 v15.24,24 | v17.78,8.89 v30.48,8.89
N$1
  Bottom 0.61: PAD73.1 PAD61.1 PAD49.1
N$2
  Bottom 0.61: PAD74.1 PAD62.1 PAD50.1
N$3
  Bottom 0.61: PAD75.1 PAD63.1 PAD51.1
N$4
  Bottom 0.61: PAD76.1 PAD64.1 PAD52.1
N$5
  Bottom 0.61: PAD77.1 PAD65.1 PAD53.1
N$6
  Bottom 0.61: PAD78.1 PAD66.1 PAD54.1
N$7
  Bottom 0.61: PAD79.1 PAD67.1 PAD55.1
N$10
  Bottom 0.61: PAD38.1 PAD57.1 PAD69.1
N$11
  Bottom 0.61: PAD39.1 PAD58.1 PAD70.1
N$12
  Bottom 0.61: PAD40.1 PAD59.1 PAD71.1
N$13
  Bottom 0.61: PAD109.1 PAD85.1 PAD97.1
N$14
  Bottom 0.61: PAD110.1 PAD86.1 PAD98.1
N$15
  Bottom 0.61: PAD99.1 PAD87.1 PAD111.1
N$16
  Bottom 0.61: PAD100.1 PAD112.1 PAD88.1
N$17
  Bottom 0.61: PAD89.1 PAD113.1 PAD101.1
N$18
  Bottom 0.61: PAD102.1 PAD114.1 PAD90.1
N$19
  Bottom 0.61: PAD103.1 PAD115.1 PAD91.1
N$20
  Bottom 0.61: PAD41.1 PAD60.1 PAD72.1
N$21
  Bottom 0.61: PAD56.1 PAD68.1 PAD80.1
N$22
  Bottom 0.61: PAD105.1 PAD81.1 PAD93.1
N$23
  Bottom 0.61: PAD106.1 PAD82.1 PAD94.1
N$24
  Bottom 0.61: PAD107.1 PAD83.1 PAD95.1
N$25
  Bottom 0.61: PAD108.1 PAD84.1 PAD96.1
N$26
  Bottom 0.61: PAD104.1 PAD116.1 PAD92.1
RX
  Top 0.356: J1_DIG_7_0_COPY.1 J1_DIG_7_0.1
TX
  Top 0.356: J1_DIG_7_0_COPY.2 J1_DIG_7_0.2

### Text on the board
Bottom: 061013 | bvwelch.com